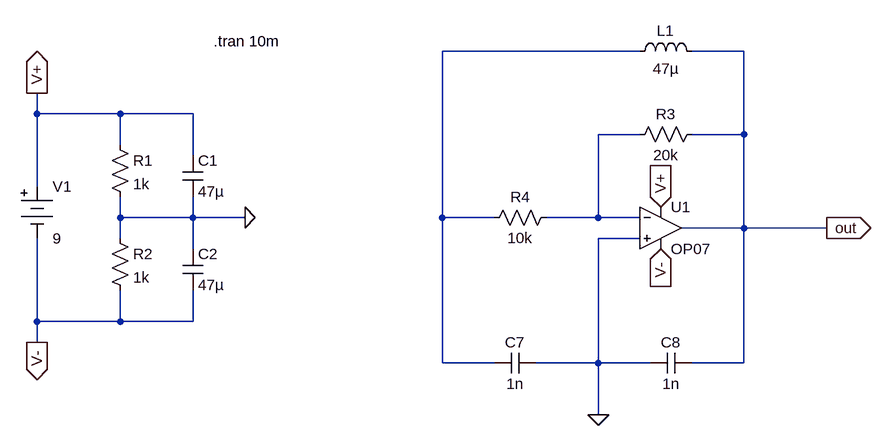
[diagram p0: schematic 1mhz-colpitts-oscillator-opamp.asc]
1mhz-colpitts-oscillator-opamp.asc, the LTspice schematic file:
Version 4
SHEET 1 2048 692
WIRE 944 112 640 112
WIRE 1104 112 1024 112
WIRE 16 208 16 176
WIRE 144 208 16 208
WIRE 256 208 144 208
WIRE 944 240 880 240
WIRE 1104 240 1104 112
WIRE 1104 240 1024 240
WIRE 144 256 144 208
WIRE 256 272 256 208
WIRE 16 320 16 208
WIRE 144 368 144 336
WIRE 256 368 256 336
WIRE 256 368 144 368
WIRE 336 368 256 368
WIRE 640 368 640 112
WIRE 720 368 640 368
WIRE 880 368 880 240
WIRE 880 368 800 368
WIRE 944 368 880 368
WIRE 1104 384 1104 240
WIRE 1104 384 1008 384
WIRE 1232 384 1104 384
WIRE 144 400 144 368
WIRE 944 400 880 400
WIRE 256 416 256 368
WIRE 16 528 16 400
WIRE 144 528 144 480
WIRE 144 528 16 528
WIRE 256 528 256 480
WIRE 256 528 144 528
WIRE 16 560 16 528
WIRE 640 592 640 368
WIRE 720 592 640 592
WIRE 880 592 880 400
WIRE 880 592 784 592
WIRE 960 592 880 592
WIRE 1104 592 1104 384
WIRE 1104 592 1024 592
WIRE 880 672 880 592
FLAG 16 176 V+
IOPIN 16 176 Out
FLAG 16 560 V-
IOPIN 16 560 Out
FLAG 336 368 0
FLAG 880 672 0
FLAG 976 352 V+
IOPIN 976 352 In
FLAG 976 416 V-
IOPIN 976 416 In
FLAG 1232 384 out
IOPIN 1232 384 Out
SYMBOL ind 928 128 R270
WINDOW 0 32 56 VTop 2
WINDOW 3 5 56 VBottom 2
SYMATTR InstName L1
SYMATTR Value 47µ
SYMBOL cap 720 608 R270
WINDOW 0 32 32 VTop 2
WINDOW 3 0 32 VBottom 2
SYMATTR InstName C7
SYMATTR Value 1n
SYMBOL cap 1024 576 R90
WINDOW 0 0 32 VBottom 2
WINDOW 3 32 32 VTop 2
SYMATTR InstName C8
SYMATTR Value 1n
SYMBOL Misc\\battery 16 304 R0
WINDOW 123 0 0 Left 0
WINDOW 39 0 0 Left 0
SYMATTR InstName V1
SYMATTR Value 9
SYMBOL res 128 240 R0
SYMATTR InstName R1
SYMATTR Value 1k
SYMBOL res 128 384 R0
SYMATTR InstName R2
SYMATTR Value 1k
SYMBOL cap 240 272 R0
SYMATTR InstName C1
SYMATTR Value 47µ
SYMBOL cap 240 416 R0
SYMATTR InstName C2
SYMATTR Value 47µ
SYMBOL OpAmps\\OP07 976 320 R0
SYMATTR InstName U1
SYMBOL res 1040 224 R90
WINDOW 0 0 56 VBottom 2
WINDOW 3 32 56 VTop 2
SYMATTR InstName R3
SYMATTR Value 20k
SYMBOL res 816 352 R90
WINDOW 0 0 56 VBottom 2
WINDOW 3 32 56 VTop 2
SYMATTR InstName R4
SYMATTR Value 10k
TEXT 288 96 Left 2 !.tran 10m

The netlist it stands for:
* 1mhz-colpitts-oscillator-opamp.asc
L1 N001 out 47µ
C7 N001 0 1n
C8 out 0 1n
V1 V+ V- 9
R1 V+ 0 1k
R2 0 V- 1k
C1 V+ 0 47µ
C2 0 V- 47µ
XU1 0 N002 V+ V- out LT1001  ; OP07, pins In+ In- V+ V- OUT
R3 out N002 20k
R4 N002 N001 10k
.tran 10m
.lib LTC.lib
.backanno
.end